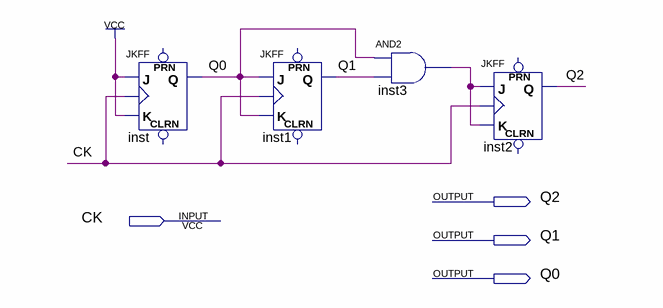
[diagram p0: schematic sheet]
// Quartus schematic 8_MOD_S_U.bdf as structural Verilog: 4 symbols, 4 pins
module \8_MOD_S_U  (
  input  CK,
  output Q2,
  output Q1,
  output Q0
);

  wire inst3_out;

  JKFF inst (.K(1'b1), .J(1'b1), .CLK(CK), .Q(Q0));  // open: PRN, CLRN
  JKFF inst1 (.K(Q0), .J(Q0), .CLK(CK), .Q(Q1));  // open: PRN, CLRN
  and inst3 (inst3_out, Q0, Q1);
  JKFF inst2 (.K(inst3_out), .J(inst3_out), .CLK(CK), .Q(Q2));  // open: PRN, CLRN
endmodule
